# Altium schematic sheet scanner_board_TOP.SchDoc
size B
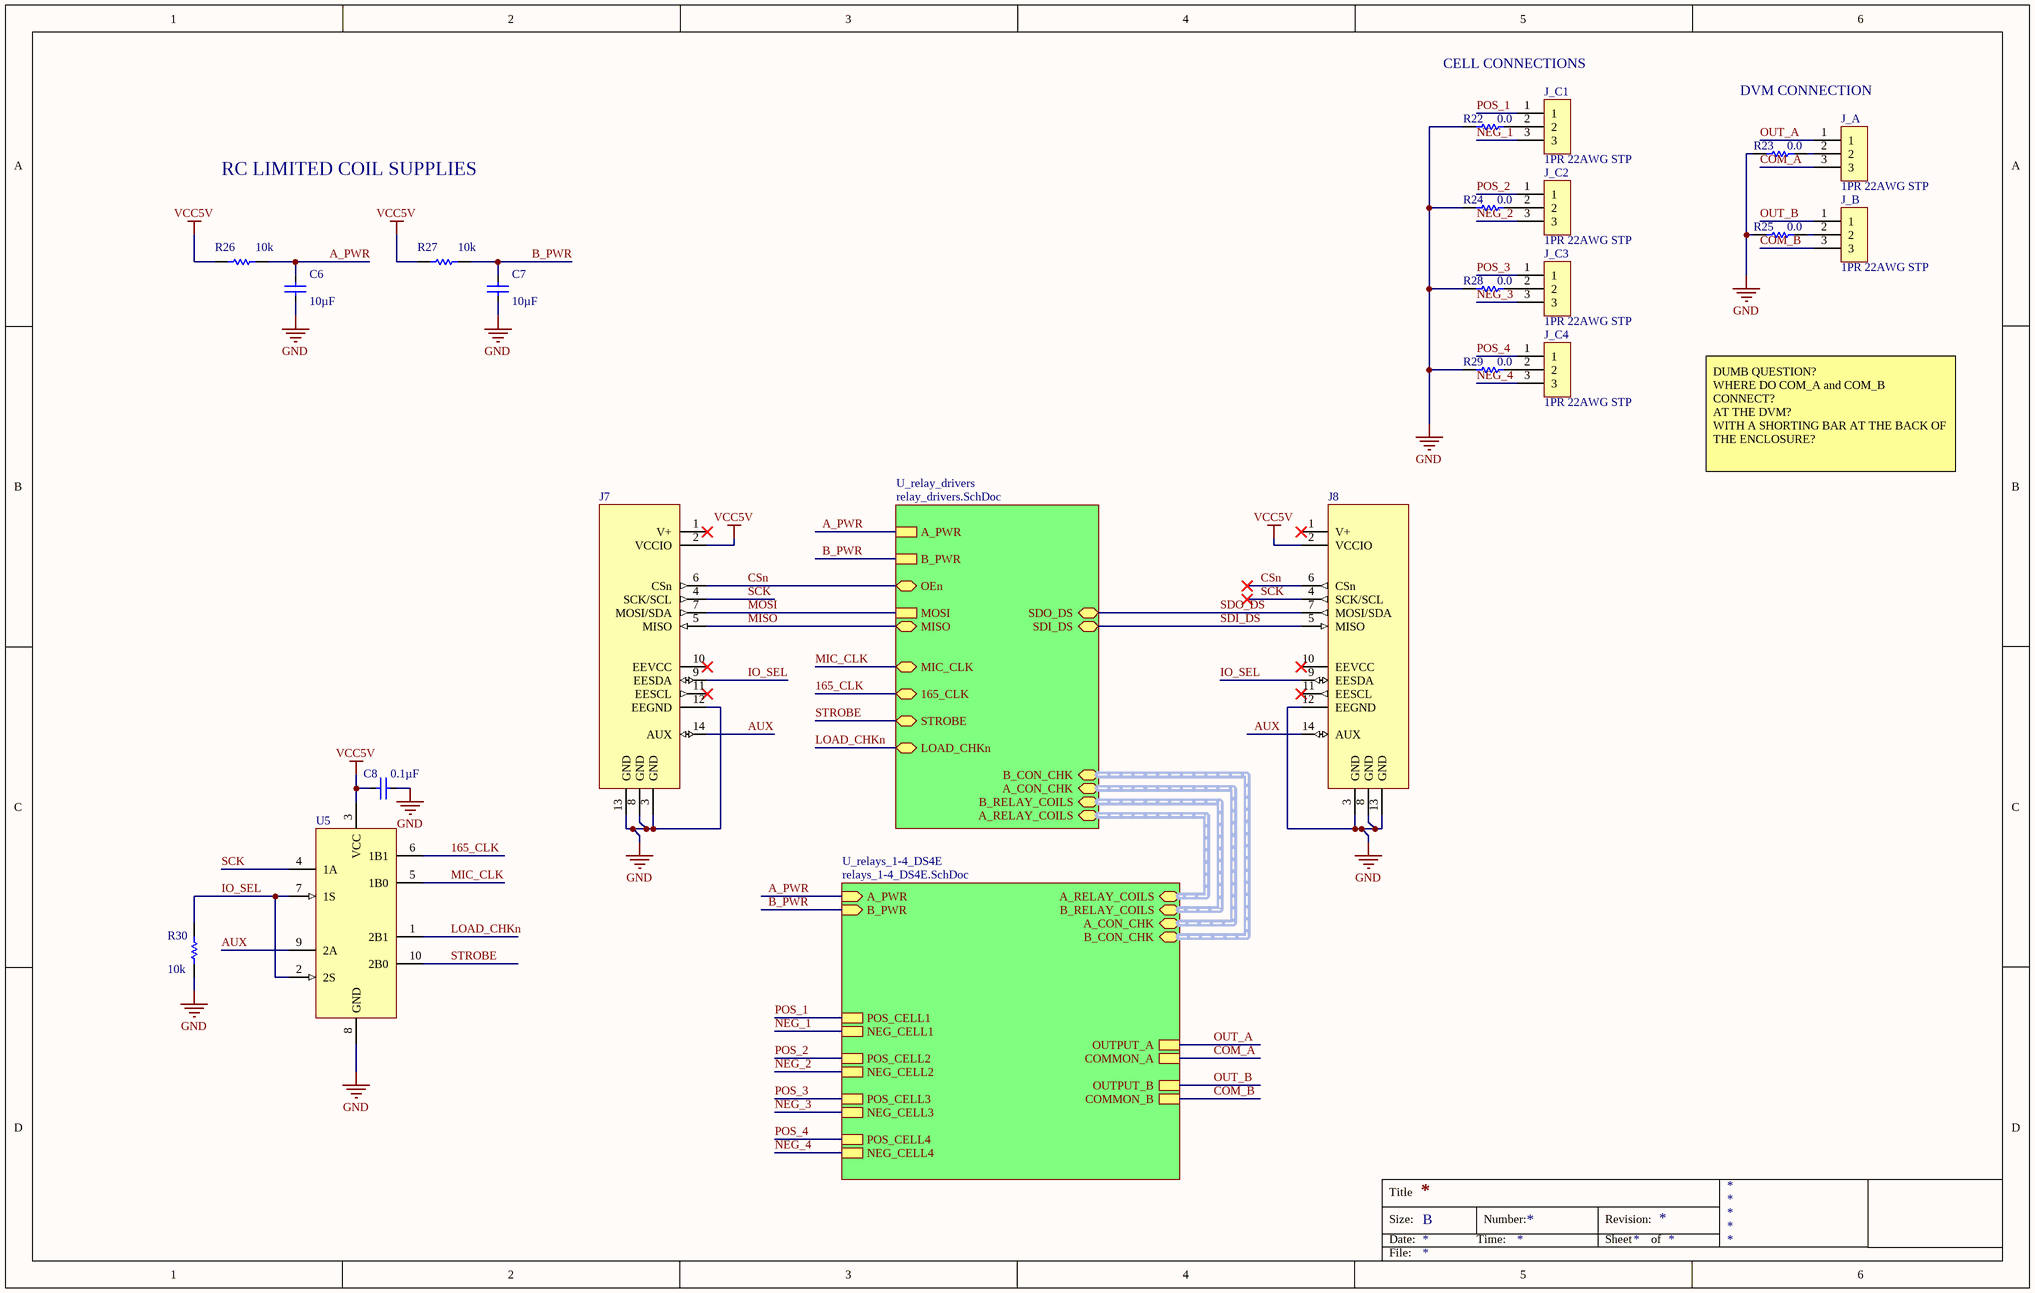
[diagram p0: scanner_board_TOP.SchDoc]

## Parts
C6  10µF  [CAPC3216X160L55N]
C7  10µF  [CAPC3216X160L55N]
C8  0.1µF  [CAPC1005X55L25N]
J7  QUIKEVAL_HEADER  [0878311420]  (value not drawn)
J8  QUIKEVAL_HEADER  [0878311420]  (value not drawn)
J_A  1PR 22AWG STP  [HDRV3W25P100_3X1_300X100H500]
J_B  1PR 22AWG STP  [HDRV3W25P100_3X1_300X100H500]
J_C1  1PR 22AWG STP  [HDRV3W25P100_3X1_300X100H500]
J_C2  1PR 22AWG STP  [HDRV3W25P100_3X1_300X100H500]
J_C3  1PR 22AWG STP  [HDRV3W25P100_3X1_300X100H500]
J_C4  1PR 22AWG STP  [HDRV3W25P100_3X1_300X100H500]
R22  0.0  [RESC2012X75L55N]
R23  0.0  [RESC2012X75L55N]
R24  0.0  [RESC2012X75L55N]
R25  0.0  [RESC2012X75L55N]
R26  10k  [RESC_3216[1206]_N]
R27  10k  [RESC_3216[1206]_N]
R28  0.0  [RESC2012X75L55N]
R29  0.0  [RESC2012X75L55N]
R30  10k  [RESC2012X75L55N]
U5  FSA2257MUX  [SOP50P490X110-10L30N]  (value not drawn)

## Sub-sheets
U_relay_drivers = relay_drivers.SchDoc: A_PWR, B_PWR, MOSI, A_RELAY_COILS (harness 4CELL_CON_REL), B_RELAY_COILS (harness 4CELL_CON_REL), SDO_DS, MIC_CLK, A_CON_CHK (harness 4CELL_CON_CHK), B_CON_CHK (harness 4CELL_CON_CHK), MISO, STROBE, LOAD_CHKn, 165_CLK, SDI_DS, OEn
U_relays_1-4_DS4E = relays_1-4_DS4E.SchDoc: POS_CELL1, A_PWR (in), NEG_CELL1, B_PWR (in), POS_CELL2, NEG_CELL2, OUTPUT_A, COMMON_A, OUTPUT_B, COMMON_B, POS_CELL3, NEG_CELL3, POS_CELL4, NEG_CELL4, A_RELAY_COILS (harness 4CELL_CON_REL), B_RELAY_COILS (harness 4CELL_CON_REL), A_CON_CHK (harness 4CELL_CON_CHK), B_CON_CHK (harness 4CELL_CON_CHK)

## Nets
GND: C6.2 C7.2 C8.2 J7.3(GND) J7.8(GND) J7.12(EEGND) J7.13(GND) J8.3(GND) J8.8(GND) J8.12(EEGND) J8.13(GND) R22.2 R23.2 R24.2 R25.2 R28.2 R29.2 R30.1 U5.8(GND)
VCC5V: C8.1 J7.2(VCCIO) J8.2(VCCIO) R26.1 R27.1 U5.3(VCC)
165_CLK: U5.6(1B1) ; sheet U_relay_drivers/165_CLK
A_PWR: C6.1 R26.2 ; sheet U_relays_1-4_DS4E/A_PWR, sheet U_relay_drivers/A_PWR
AUX: J7.14(AUX) J8.14(AUX) U5.9(2A)
B_PWR: C7.1 R27.2 ; sheet U_relays_1-4_DS4E/B_PWR, sheet U_relay_drivers/B_PWR
COM_A: J_A.3 ; sheet U_relays_1-4_DS4E/COMMON_A
COM_B: J_B.3 ; sheet U_relays_1-4_DS4E/COMMON_B
CSn: J7.6(CSn) J8.6(CSn) ; sheet U_relay_drivers/OEn
IO_SEL: J7.9(EESDA) J8.9(EESDA) R30.2 U5.2(2S) U5.7(1S)
LOAD_CHKn: U5.1(2B1) ; sheet U_relay_drivers/LOAD_CHKn
MIC_CLK: U5.5(1B0) ; sheet U_relay_drivers/MIC_CLK
MISO: J7.5(MISO) ; sheet U_relay_drivers/MISO
MOSI: J7.7(MOSI/SDA) ; sheet U_relay_drivers/MOSI
NEG_1: J_C1.3 ; sheet U_relays_1-4_DS4E/NEG_CELL1
NEG_2: J_C2.3 ; sheet U_relays_1-4_DS4E/NEG_CELL2
NEG_3: J_C3.3 ; sheet U_relays_1-4_DS4E/NEG_CELL3
NEG_4: J_C4.3 ; sheet U_relays_1-4_DS4E/NEG_CELL4
OUT_A: J_A.1 ; sheet U_relays_1-4_DS4E/OUTPUT_A
OUT_B: J_B.1 ; sheet U_relays_1-4_DS4E/OUTPUT_B
POS_1: J_C1.1 ; sheet U_relays_1-4_DS4E/POS_CELL1
POS_2: J_C2.1 ; sheet U_relays_1-4_DS4E/POS_CELL2
POS_3: J_C3.1 ; sheet U_relays_1-4_DS4E/POS_CELL3
POS_4: J_C4.1 ; sheet U_relays_1-4_DS4E/POS_CELL4
SCK: J7.4(SCK/SCL) J8.4(SCK/SCL) U5.4(1A)
SDI_DS: J8.5(MISO) ; sheet U_relay_drivers/SDI_DS
SDO_DS: J8.7(MOSI/SDA) ; sheet U_relay_drivers/SDO_DS
STROBE: U5.10(2B0) ; sheet U_relay_drivers/STROBE
NetJ_A_2: J_A.2 R23.1
NetJ_B_2: J_B.2 R25.1
NetJ_C1_2: J_C1.2 R22.1
NetJ_C2_2: J_C2.2 R24.1
NetJ_C3_2: J_C3.2 R28.1
NetJ_C4_2: J_C4.2 R29.1

Not connected (* = marked no-connect by the designer): J7 1(V+)* 10(EEVCC)* 11(EESCL)*; J8 1(V+)* 10(EEVCC)* 11(EESCL)*

## Buses and harness runs
harness sheet U_relay_drivers/A_CON_CHK = sheet U_relays_1-4_DS4E/A_CON_CHK
harness sheet U_relay_drivers/A_RELAY_COILS = sheet U_relays_1-4_DS4E/A_RELAY_COILS
harness sheet U_relay_drivers/B_CON_CHK = sheet U_relays_1-4_DS4E/B_CON_CHK
harness sheet U_relay_drivers/B_RELAY_COILS = sheet U_relays_1-4_DS4E/B_RELAY_COILS

## Notes on the sheet
- CELL CONNECTIONS
- DVM CONNECTION
- RC LIMITED COIL SUPPLIES
- DUMB QUESTION?
  WHERE DO COM_A and COM_B CONNECT?
  AT THE DVM?
  WITH A SHORTING BAR AT THE BACK OF THE ENCLOSURE?
- Title
- Size:
- Date:
- B
- Time:
- Number:
- Revision:
- Sheet
- of
- File:

## Library data of the parts
C6 C7 = GRM31CR71E106KA12L: CAP CER 10UF 25V X7R 1206; Manufacturer: Murata Electronics North America; Tolerance: ±10%; Design Item Id: GRM31CR71E106KA12L; Supplier 1: Digi-Key; Supplier Part Number 1: 490-6518-1-ND; Manufacturer Part Number: GRM31CR71E106KA12L; RoHS: RoHS Compliant; Category: Capacitors; Stock 1: 157542; Pricing 1: 1=0.83, 10=0.706, 50=0.5194, 100=0.4129, 250=0.34632, 500=0.31302, 1000=0.28638 (USD); Packaging: Cut Tape (CT); Applications: General Purpose; Operating Temperature: -55°C ~ 125°C; Mounting Type: Surface Mount, MLCC; Package / Case: 1206 (3216 Metric); ComponentLink1URL: http://www.murata.com/~/media/webrenewal/support/library/catalog/products/capacitor/mlcc/c02e.pdf; ComponentLink1Description: http://www.murata.com/~/media/webrenewal/support/library/catalog/products/capacitor/mlcc/c02e.pdf; Capacitance: 10µF; Voltage - Rated: 25V; Temperature Coefficient: X7R; Ratings: -; Size / Dimension: 0.126" L x 0.063" W (3.20mm x 1.60mm); Height - Seated (Max): -; Thickness (Max): 0.071" (1.80mm); Lead Spacing: -; Features: -; Lead Style: -
C8 = GRM155R71C104JA88D: CAP CER 0.1UF 16V X7R 0402; Manufacturer: Murata Electronics North America; Tolerance: ±5%; Design Item Id: GRM155R71C104JA88D; Supplier 1: Digi-Key; Supplier Part Number 1: 490-6327-1-ND; Manufacturer Part Number: GRM155R71C104JA88D; RoHS: RoHS Compliant; Category: Capacitors; Stock 1: 844721; Pricing 1: 1=0.1, 10=0.026, 50=0.0144, 100=0.0121, 250=0.00992, 500=0.00848, 1000=0.0066, 5000=0.0055 (USD); Packaging: Cut Tape (CT); Applications: General Purpose; Operating Temperature: -55°C ~ 125°C; Mounting Type: Surface Mount, MLCC; Package / Case: 0402 (1005 Metric); ComponentLink1URL: http://www.murata.com/~/media/webrenewal/support/library/catalog/products/capacitor/mlcc/c02e.pdf; ComponentLink1Description: http://www.murata.com/~/media/webrenewal/support/library/catalog/products/capacitor/mlcc/c02e.pdf; Capacitance: 0.1µF; Voltage - Rated: 16V; Temperature Coefficient: X7R; Ratings: -; Size / Dimension: 0.039" L x 0.020" W (1.00mm x 0.50mm); Height - Seated (Max): -; Thickness (Max): 0.022" (0.55mm); Lead Spacing: -; Features: -; Lead Style: *
J7 J8 = 0878311420: CONN HEADER 14POS 2MM VERT GOLD; Manufacturer: Molex, LLC; Design Item Id: 0878311420; Supplier 1: Digi-Key; Supplier Part Number 1: WM17469-ND; Manufacturer Part Number: 0878311420; RoHS: RoHS Compliant; Category: Connectors, Interconnects; Stock 1: 20079; Pricing 1: 1=1.37, 10=1.239, 100=1.062, 500=0.88498, 1000=0.75855, 5000=0.67258, 10000=0.65741 (USD); Packaging: Tube
J_A J_B J_C1-J_C4 = CON-STP-22AWG-x3: SOLDER HOLES FOR 3 22AWG WIRES; Design Item Id: CON-STP-22AWG-x3
R22-R25 R28 R29 = ERJ-6BWFR030V: RES SMD 0.03 OHM 1% 1/2W 0805; Manufacturer: Panasonic Electronic Components; Resistance: 0.03; Power (Watts): 0.5W, 1/2W; Temperature Coefficient: ±200ppm/°C; Design Item Id: ERJ-6BWFR030V; Footprint: RESC_2012[0805]_N; Supplier 1: Digi-Key; Supplier Part Number 1: P.03AQCT-ND; Manufacturer Part Number: ERJ-6BWFR030V; RoHS: RoHS Compliant; Category: Resistors; Stock 1: 75764; Pricing 1: 1=0.66, 50=0.3466, 100=0.2859, 250=0.24832, 500=0.20212, 1000=0.16031 (USD); Packaging: Cut Tape (CT); Operating Temperature: -55°C ~ 155°C; Package / Case: 0805 (2012 Metric); Supplier Device Package: 0805; ComponentLink1URL: http://industrial.panasonic.com/lecs/www-data/pdf/AOA0000/AOA0000CE3.pdf; ComponentLink1Description: http://industrial.panasonic.com/lecs/www-data/pdf/AOA0000/AOA0000CE3.pdf; Tolerance: ±1%; Composition: Thick Film; Features: Automotive AEC-Q200, Current Sense; Size / Dimension: 0.079" L x 0.049" W (2.00mm x 1.25mm); Height: 0.028" (0.70mm); Number of Terminations: 2
R26 R27 = CRCW120610K0JNEA: RES SMD 10K OHM 5% 1/4W 1206; Manufacturer: Vishay Dale; Power (Watts): 0.25W, 1/4W; Temperature Coefficient: ±200ppm/°C; Resistance: 10k; Design Item Id: CRCW120610K0JNEA; Supplier 1: Digi-Key; Supplier Part Number 1: 541-10KECT-ND; Manufacturer Part Number: CRCW120610K0JNEA; RoHS: RoHS Compliant; Category: Resistors; Stock 1: 299066; Pricing 1: 10=0.04, 50=0.0214, 200=0.01235, 1000=0.00841 (USD); Packaging: Cut Tape (CT); Operating Temperature: -55°C ~ 155°C; Package / Case: 1206 (3216 Metric); Supplier Device Package: 1206 (3216 Metric); ComponentLink1URL: http://www.vishay.com/docs/20035/dcrcwe3.pdf; ComponentLink1Description: http://www.vishay.com/docs/20035/dcrcwe3.pdf; Tolerance: ±5%; Composition: Thick Film; Features: Automotive AEC-Q200; Size / Dimension: 0.126" L x 0.063" W (3.20mm x 1.60mm); Height: 0.024" (0.60mm); Number of Terminations: 2
R30 = ERJ-P06J103V: RES SMD 10K OHM 5% 1/2W 0805; Manufacturer: Panasonic Electronic Components; Power (Watts): 0.5W, 1/2W; Temperature Coefficient: ±200ppm/°C; Resistance: 10k; Design Item Id: ERJ-P06J103V; Supplier 1: Digi-Key; Supplier Part Number 1: P10KADCT-ND; Manufacturer Part Number: ERJ-P06J103V; RoHS: RoHS Compliant; Category: Resistors; Stock 1: 181490; Pricing 1: 1=0.12, 10=0.112, 100=0.0429, 1000=0.01889, 2500=0.01632 (USD); Packaging: Cut Tape (CT); Operating Temperature: -55°C ~ 155°C; Package / Case: 0805 (2012 Metric); Supplier Device Package: 0805; ComponentLink1URL: https://industrial.panasonic.com/cdbs/www-data/pdf/RDO0000/AOA0000C331.pdf; ComponentLink1Description: https://industrial.panasonic.com/cdbs/www-data/pdf/RDO0000/AOA0000C331.pdf; Tolerance: ±5%; Composition: Thick Film; Features: Automotive AEC-Q200, Pulse Withstanding; Size / Dimension: 0.079" L x 0.049" W (2.00mm x 1.25mm); Part Status: Active; Height - Seated (Max): 0.028" (0.70mm); Failure Rate: -
U5 = FSA2257MUX: IC SWITCH DUAL SPDT 10MSOP; Manufacturer: Fairchild/ON Semiconductor; Multiplexer/Demultiplexer Circuit: 2:1; On-State Resistance (Max): 1.5 Ohm (Typ); Design Item Id: FSA2257MUX; Supplier 1: Digi-Key; Supplier Part Number 1: FSA2257MUXCT-ND; Manufacturer Part Number: FSA2257MUX; RoHS: RoHS Compliant; Category: Integrated Circuits (ICs); Stock 1: 2927; Pricing 1: 1=0.85, 10=0.748, 100=0.5733, 500=0.4532, 1000=0.36256 (USD); Packaging: Cut Tape (CT); ComponentLink1URL: https://www.fairchildsemi.com/datasheets/FS/FSA2257.pdf; ComponentLink1Description: https://www.fairchildsemi.com/datasheets/FS/FSA2257.pdf; Part Status: Active; Switch Circuit: SPDT